# EAGLE schematic roboproj q4 (EAGLE 9.6.2)
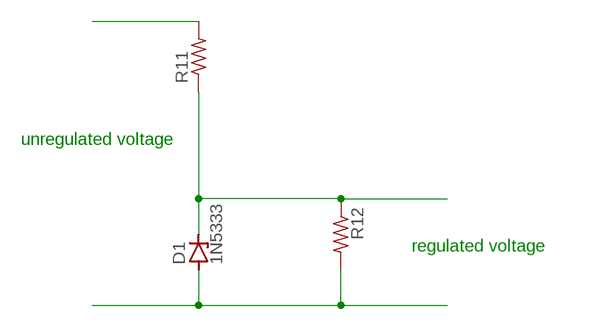
[diagram p0: schematic, sheet 1]

## Parts
D1  1N5333  [C1702-15]
R11  R-US_R0805  [R0805]
R12  R-US_R0805  [R0805]

## Nets
N$13: D1.C R11.1 R12.1
N$14: D1.A R12.2
N$15: R11.2

## Notes on the sheet
- unregulated voltage
- regulated voltage

## Library data of the parts
D1 = diode:1N5333: Z DIODE 3.3 V, 5W, 5 percent (Motorola)
R11 R12 = rcl:R-US_: RESISTOR, American symbol; SPICEPREFIX: R